# EAGLE design Full_Schematic (EAGLE 9.6.2)
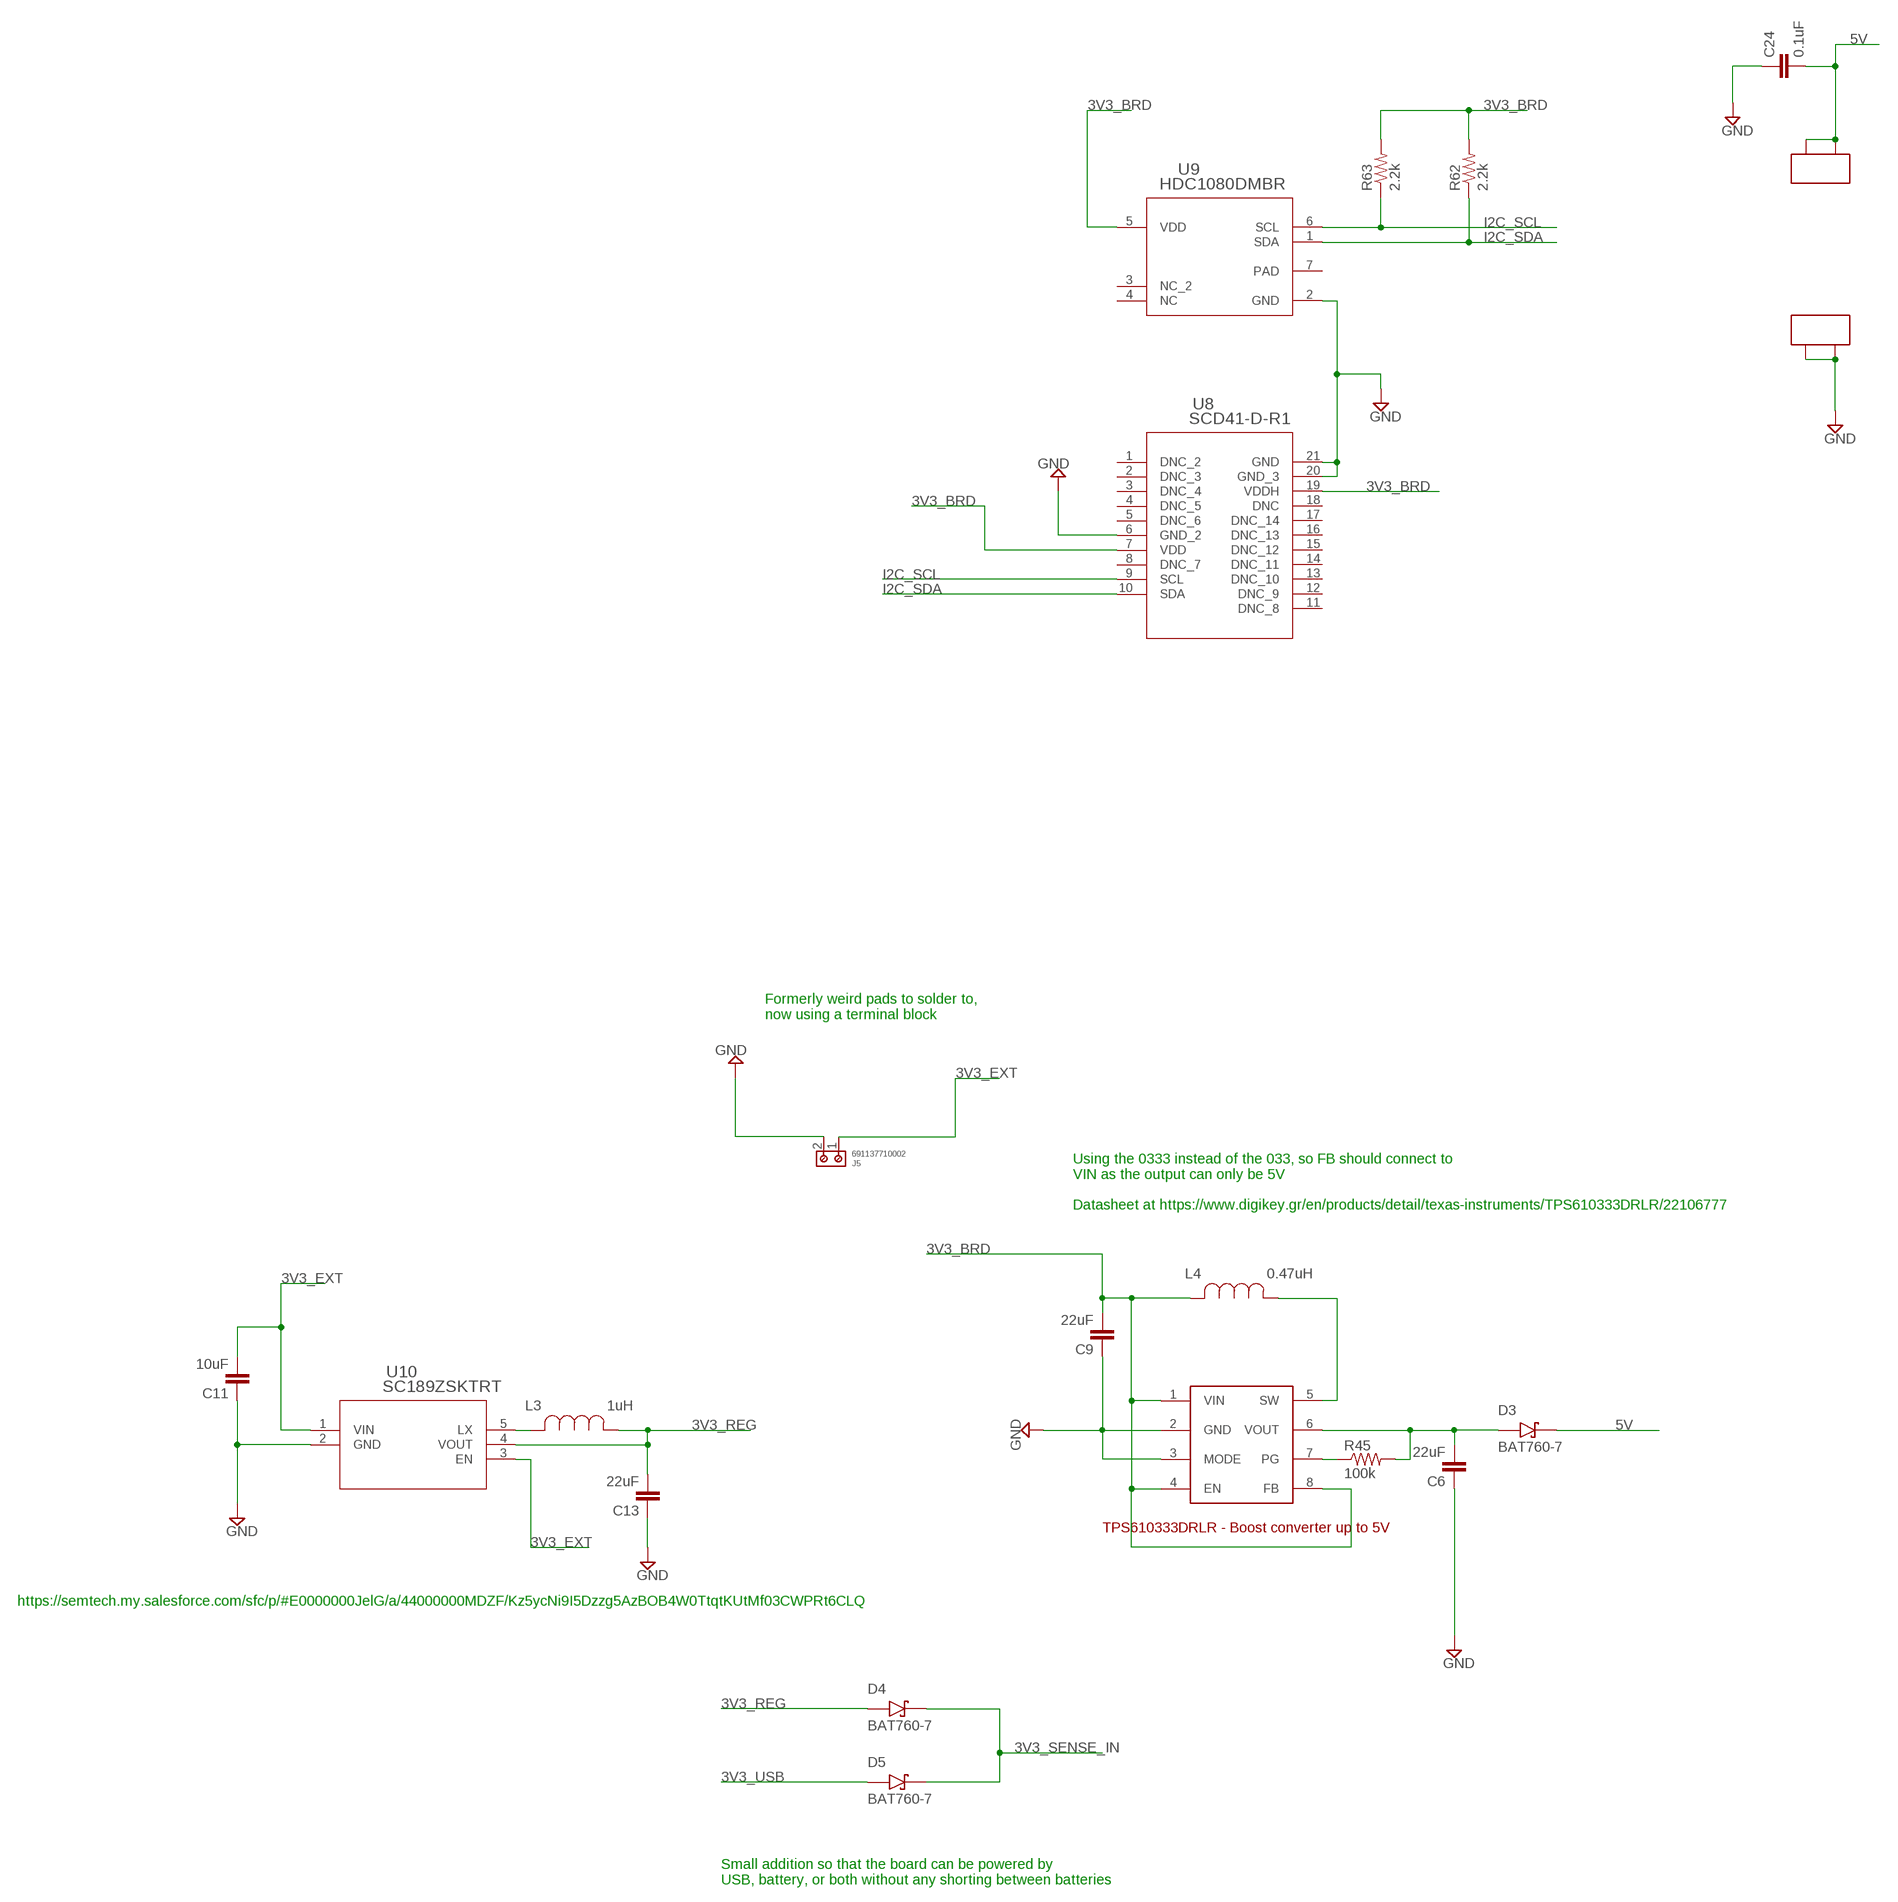
[diagram p0: schematic, sheet 1, part 1 of 3]
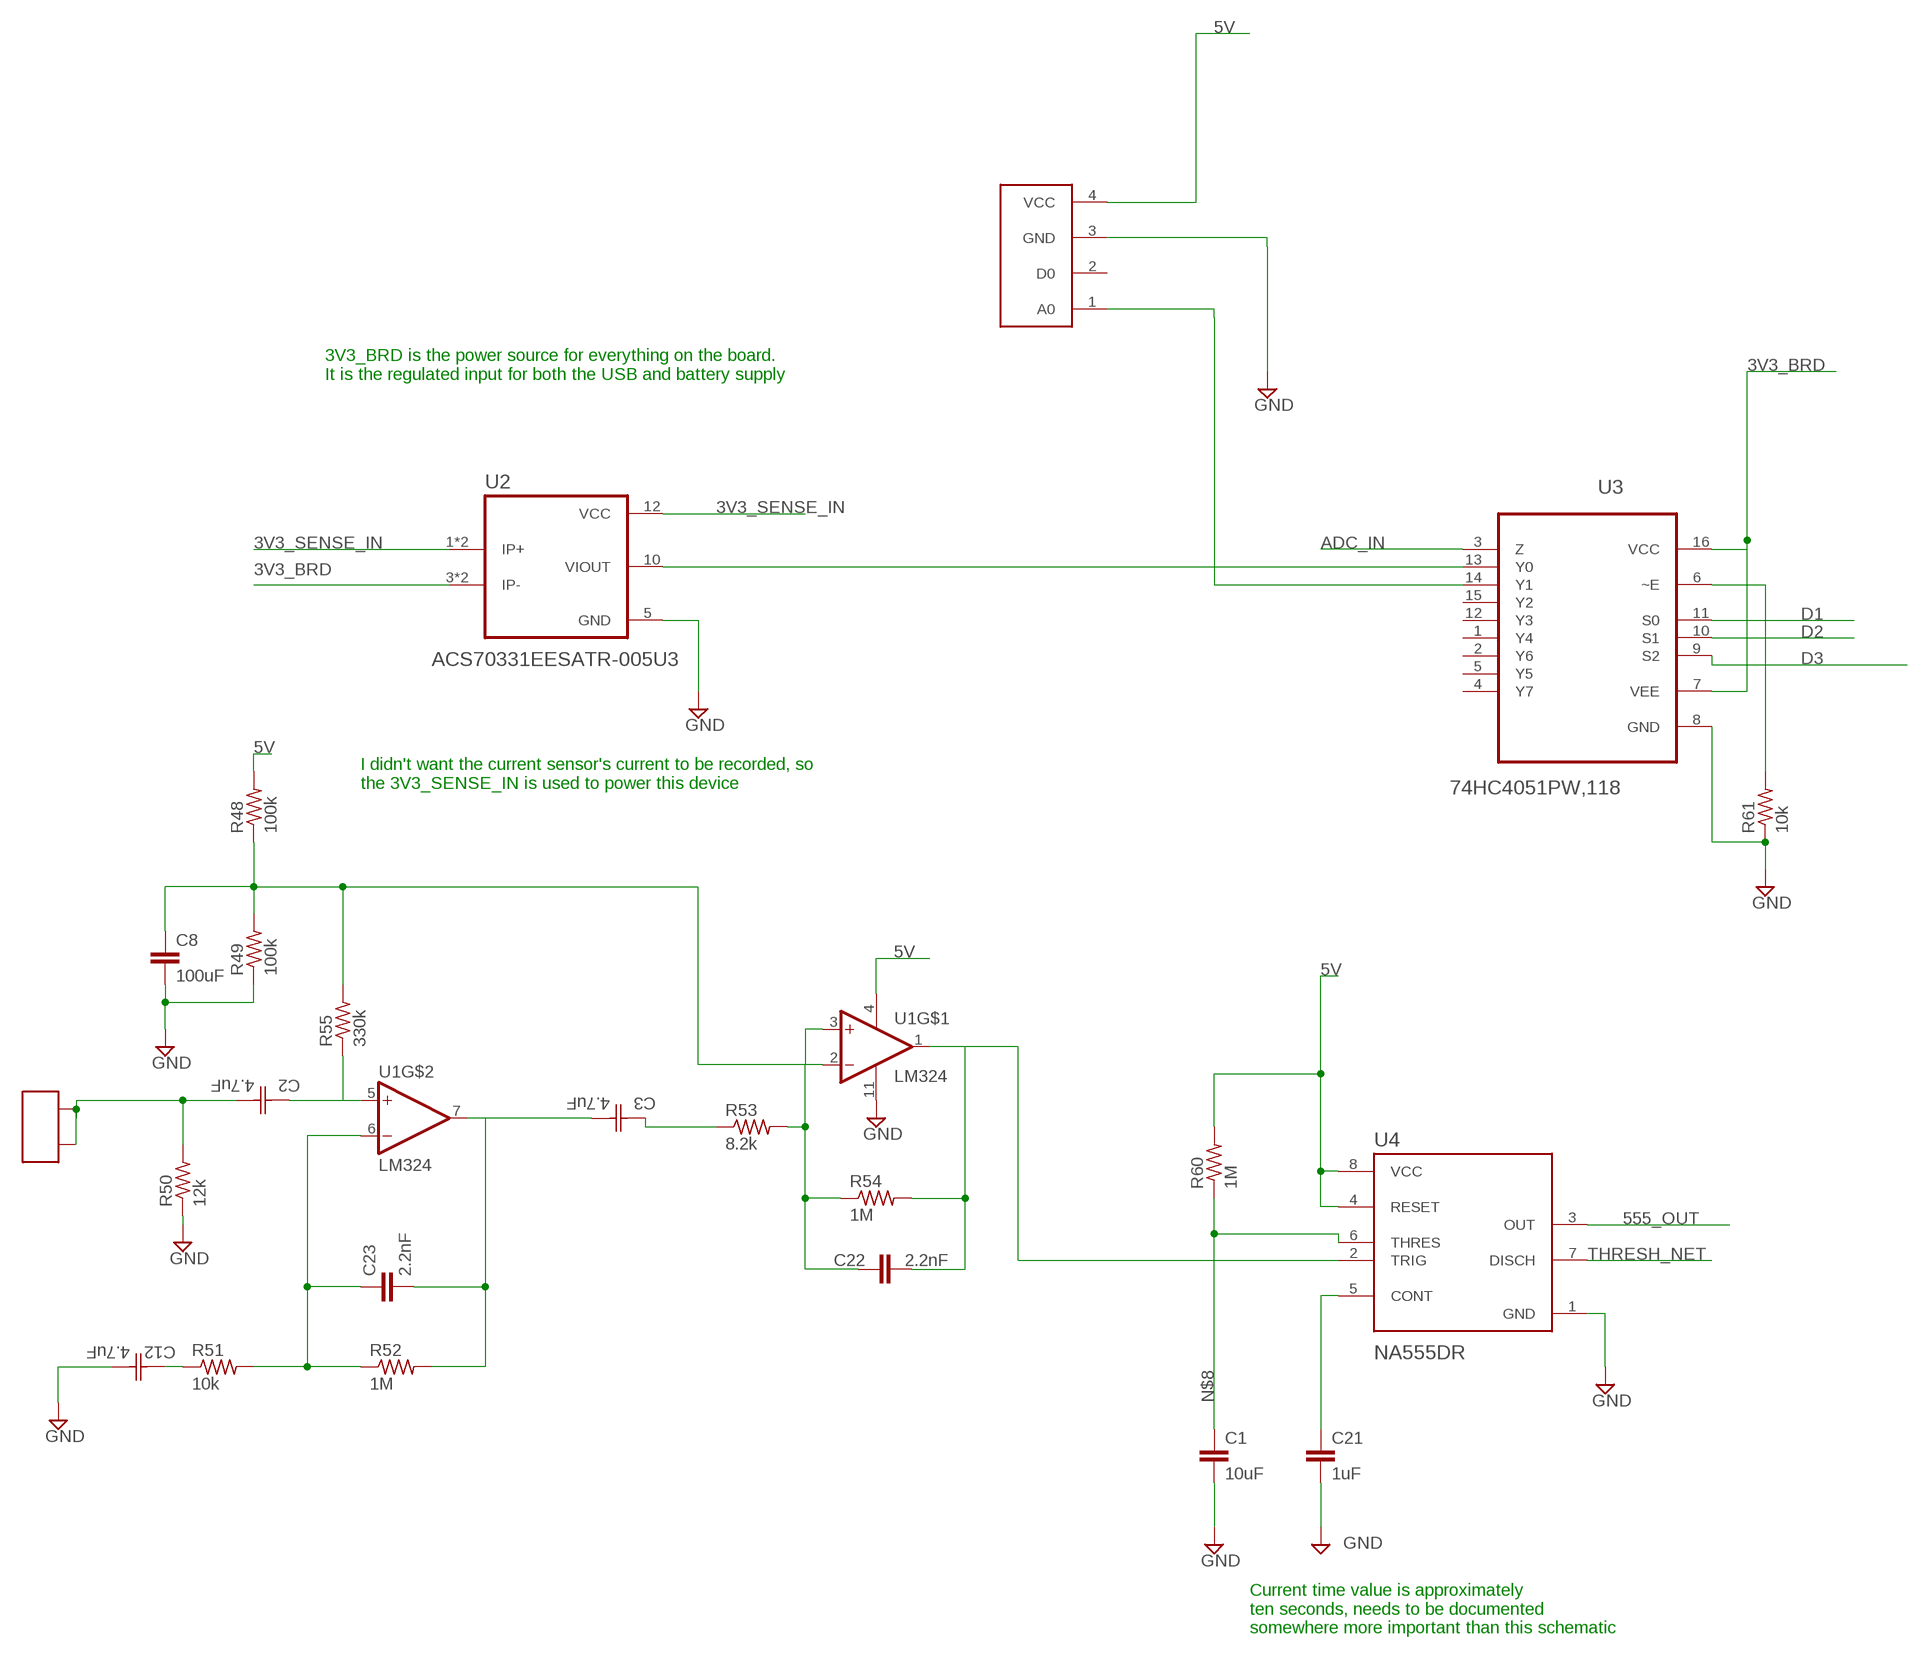
[diagram p1: schematic, sheet 1, part 2 of 3]
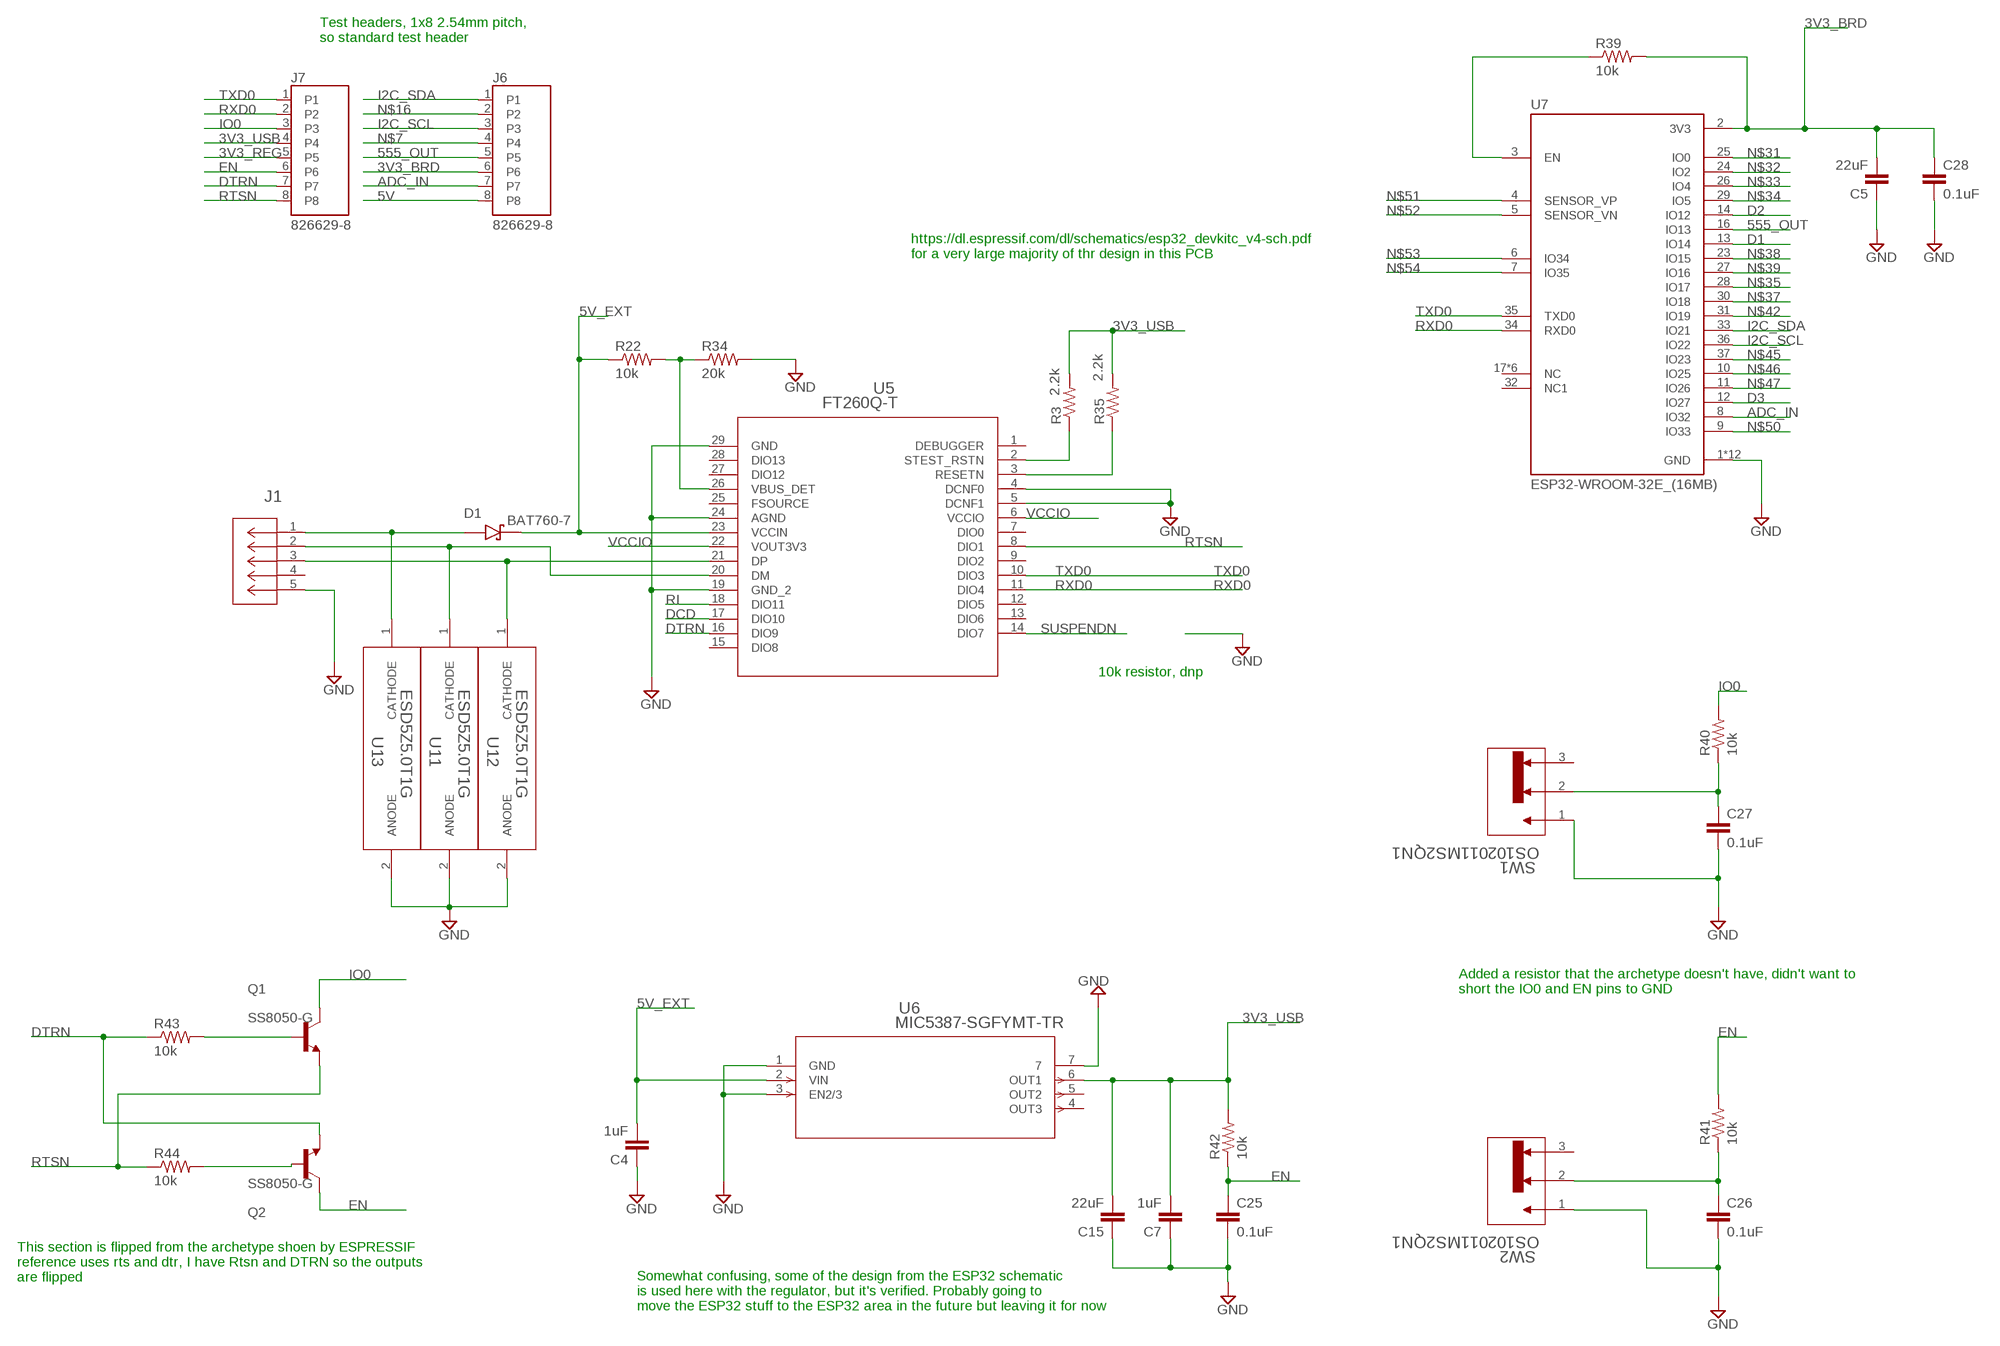
[diagram p2: schematic, sheet 1, part 3 of 3]

## Parts
C1  10uF  C-EUC0603  [C0603]
C2  4.7uF  860020472001  [CAP_WCAP-ATG5_5X11_WRE]
C3  4.7uF  860020472001  [CAP_WCAP-ATG5_5X11_WRE]
C4  1uF  C-EUC0603  [C0603]
C5  22uF  C-EUC0603  [C0603]
C6  22uF  C-EUC0603  [C0603]
C7  1uF  C-EUC0603  [C0603]
C8  100uF  C-EUC1206  [C1206]
C9  22uF  C-EUC0603  [C0603]
C11  10uF  C-EUC0603  [C0603]
C12  4.7uF  860020472001  [CAP_WCAP-ATG5_5X11_WRE]
C13  22uF  C-EUC0603  [C0603]
C15  22uF  C-EUC0603  [C0603]
C21  1uF  C-EUC0402  [C0402]
C22  2.2nF  C-EUC0402  [C0402]
C23  2.2nF  C-EUC0402  [C0402]
C24  0.1uF  C-EUC0402  [C0402]
C25  0.1uF  C-EUC0402  [C0402]
C26  0.1uF  C-EUC0402  [C0402]
C27  0.1uF  C-EUC0402  [C0402]
C28  0.1uF  C-EUC0402  [C0402]
D1  BAT760-7  [SOD2513X120N]
D3  BAT760-7  [SOD2513X120N]
D4  BAT760-7  [SOD2513X120N]
D5  BAT760-7  [SOD2513X120N]
J1  10118193-0001LF  [CONN_10118193-0001LF_AMP]
J5  691137710002  [691137710002]
J6  826629-8  [TE_826629-8]
J7  826629-8  [TE_826629-8]
L3  1uH  DFE252012P-1R0M=P2  [DFE252012P-1R0M=P2]
L4  0.47uH  DFE252012P-1R0M=P2  [DFE252012P-1R0M=P2]
Q1  SS8050-G  [TRANS_SS8050-G]
Q2  SS8050-G  [TRANS_SS8050-G]
R3  2.2k  R-US_R0402  [R0402]
R22  10k  R-US_R0402  [R0402]
R34  20k  R-US_R0402  [R0402]
R35  2.2k  R-US_R0402  [R0402]
R39  10k  R-US_R0402  [R0402]
R40  10k  R-US_R0402  [R0402]
R41  10k  R-US_R0402  [R0402]
R42  10k  R-US_R0402  [R0402]
R43  10k  R-US_R0402  [R0402]
R44  10k  R-US_R0402  [R0402]
R45  100k  R-US_R0402  [R0402]
R48  100k  R-US_R0402  [R0402]
R49  100k  R-US_R0402  [R0402]
R50  12k  R-US_R0402  [R0402]
R51  10k  R-US_R0402  [R0402]
R52  1M  R-US_R0402  [R0402]
R53  8.2k  R-US_R0402  [R0402]
R54  1M  R-US_R0402  [R0402]
R55  330k  R-US_R0402  [R0402]
R60  1M  R-US_R0402  [R0402]
R61  10k  R-US_R0402  [R0402]
R62  2.2k  R-US_R0402  [R0402]
R63  2.2k  R-US_R0402  [R0402]
SW1  OS102011MS2QN1  [SPDT_OS102011_CNK]
SW2  OS102011MS2QN1  [SPDT_OS102011_CNK]
U1  LM324  [SOIC127P600X175-14N]
U2  ACS70331EESATR-005U3  [ALLEGRO_ACS70331EESATR-005U3]
U3  74HC4051PW,118  [SOP65P640X110-16N]
U4  NA555DR  [SOIC127P599X175-8N]
U5  FT260Q-T  [WQFN-28_FTD]
U6  MIC5387-SGFYMT-TR  [MLF-6_MT_MCH]
U7  ESP32-WROOM-32E_(16MB)  [XCVR_ESP32-WROOM-32E_(16MB)]
U8  SCD41-D-R1  [SCD41-D-R1_SEN]
U9  HDC1080DMBR  [DMB0006A]
U10  SC189ZSKTRT  [SOT23-5-SC189_SEM]
U11  ESD5Z5.0T1G  [SOD-523_0P9X1P3_ONS]
U12  ESD5Z5.0T1G  [SOD-523_0P9X1P3_ONS]
U13  ESD5Z5.0T1G  [SOD-523_0P9X1P3_ONS]
U$1  2PIN_HEADER  [2PIN_HEADER]
U$2  2PIN_HEADER  [2PIN_HEADER]
U$3  MQ_7  [MQ-7]
U$4  TPS610333DRLR  [TPS610333DRLR]
U$5  2PIN_HEADER  [2PIN_HEADER]

## Nets
3V3_BRD: C5.2 C9.2 C28.1 J6.6 L4.2 R39.2 R62.2 R63.2 U2.3(IP-) U2.4(IP-) U3.7(VEE) U3.16(VCC) U7.2(3V3) U8.7(VDD) U8.19(VDDH) U9.5(VDD) U$4.1(VIN) U$4.4(EN) U$4.8(FB)
3V3_EXT: C11.2 J5.1 U10.1(VIN) U10.3(EN)
3V3_REG: C13.2 D4.A J7.5 L3.1 U10.4(VOUT)
3V3_SENSE_IN: D4.C(K) D5.C(K) U2.1(IP+) U2.2(IP+) U2.12(VCC)
3V3_USB: C7.2 C15.2 D5.A J7.4 R3.2 R35.2 R42.2 U6.6(OUT1)
5V: C24.2 D3.C(K) J6.8 R48.2 R60.2 U1.4(VCC+) U4.4(RESET) U4.8(VCC) U$2.1 U$2.2 U$3.4(VCC)
5V1: C6.2 D3.A R45.2 U$4.6(VOUT)
5V_EXT: C4.2 D1.C(K) R22.1 U5.23(VCCIN) U6.2(VIN)
555_OUT: J6.5 U4.3(OUT) U7.16(IO13)
ADC_IN: J6.7 U3.3(Z) U7.8(IO32)
D1: U3.11(S0) U7.13(IO14)
D2: U3.10(S1) U7.14(IO12)
D3: U3.9(S2) U7.12(IO27)
DCD: U5.17(DIO10)
DTRN: J7.7 Q2.2(E) R43.1 U5.16(DIO9)
EN: C25.1 J7.6 Q2.3(C) R41.2 R42.1
GND: C1.2 C4.1 C5.1 C6.1 C7.1 C8.2 C9.1 C11.1 C12.2 C13.1 C15.1 C21.2 C24.1 C25.2 C26.2 C27.2 C28.2 J1.5 J5.2 R34.2 R49.1 R50.1 R61.1 SW1.1 SW2.1 U1.11(VCC-) U2.5(GND) U3.8(GND) U4.1(GND) U5.4(DCNF0) U5.5(DCNF1) U5.19(GND_2) U5.24(AGND) U5.29(GND) U6.1(GND) U6.3(EN2/3) U6.7 U7.1(GND) U7.15(GND) U7.38(GND) U7.39_1(GND) U7.39_2(GND) U7.39_3(GND) U7.39_4(GND) U7.39_5(GND) U7.39_6(GND) U7.39_7(GND) U7.39_8(GND) U7.39_9(GND) U8.6(GND_2) U8.20(GND_3) U8.21(GND) U9.2(GND) U10.2(GND) U11.2(ANODE) U12.2(ANODE) U13.2(ANODE) U$3.3(GND) U$4.2(GND) U$4.3(MODE) U$5.1 U$5.2
I2C_SCL: J6.3 R63.1 U7.36(IO22) U8.9(SCL) U9.6(SCL)
I2C_SDA: J6.1 R62.1 U7.33(IO21) U8.10(SDA) U9.1(SDA)
IO0: J7.3 Q1.3(C) R40.2
N$2: C26.1 R41.1 SW2.2
N$3: C23.1 R51.2 R52.1 U1.6(INVERTING_INPUT2)
N$4: C3.2 C23.2 R52.2 U1.7(OUTPUT2)
N$5: C3.1 R53.1
N$6: C22.1 R53.2 R54.1 U1.3(NON-INVERTING_INPUT1)
N$7: J6.4 U2.10(VIOUT) U3.13(Y0)
N$8: C1.1 R60.1 U4.6(THRES)
N$9: C8.1 R48.1 R49.2 R55.2 U1.2(INVERTING_INPUT1)
N$10: C27.1 R40.1 SW1.2
N$12: C12.1 R51.1
N$16: J6.2 U3.14(Y1) U$3.1(A0)
N$19: C21.1 U4.5(CONT)
N$20: D1.A J1.1 U13.1(CATHODE)
N$21: R61.2 U3.6(~E)
N$22: J1.2 U5.20(DM) U11.1(CATHODE)
N$23: J1.3 U5.21(DP) U12.1(CATHODE)
N$24: Q1.1(B) R43.2
N$25: Q2.1(B) R44.2
N$26: R35.1 U5.3(RESETN)
N$27: R22.2 R34.1 U5.26(VBUS_DET)
N$28: R39.1 U7.3(EN)
N$29: C2.2 R50.2 U$1.1 U$1.2
N$30: R3.1 U5.2(STEST_RSTN)
N$31: U7.25(IO0)
N$32: U7.24(IO2)
N$33: U7.26(IO4)
N$34: U7.29(IO5)
N$35: U7.28(IO17)
N$37: U7.30(IO18)
N$38: U7.23(IO15)
N$39: U7.27(IO16)
N$42: U7.31(IO19)
N$45: U7.37(IO23)
N$46: U7.10(IO25)
N$47: U7.11(IO26)
N$50: U7.9(IO33)
N$51: U7.4(SENSOR_VP)
N$52: U7.5(SENSOR_VN)
N$53: U7.6(IO34)
N$54: U7.7(IO35)
N$55: L3.2 U10.5(LX)
N$56: L4.1 U$4.5(SW)
N$57: R45.1 U$4.7(PG)
N$60: C2.1 R55.1 U1.5(NON-INVERTING_INPUT2)
RI: U5.18(DIO11)
RTSN: J7.8 Q1.2(E) R44.1 U5.8(DIO1)
RXD0: J7.2 U5.11(DIO4) U7.34(RXD0)
SUSPENDN: U5.14(DIO7)
THRESH_NET: C22.2 R54.2 U1.1(OUTPUT1) U4.2(TRIG) U4.7(DISCH)
TXD0: J7.1 U5.10(DIO3) U7.35(TXD0)
VCCIO: U5.6(VCCIO) U5.22(VOUT3V3)
Unconnected: J1.4 SW1.3 SW2.3 U1.8(OUTPUT3) U1.9(INVERTING_INPUT3) U1.10(NON-INVERTING_INPUT3) U1.12(NON-INVERTING_INPUT4) U1.13(INVERTING_INPUT4) U1.14(OUTPUT4) U3.1(Y4) U3.2(Y6) U3.4(Y7) U3.5(Y5) U3.12(Y3) U3.15(Y2) U5.1(DEBUGGER) U5.7(DIO0) U5.9(DIO2) U5.12(DIO5) U5.13(DIO6) U5.15(DIO8) U5.27(DIO12) U5.28(DIO13) U6.4(OUT3) U6.5(OUT2) U7.17(NC) U7.18(NC) U7.19(NC) U7.20(NC) U7.21(NC) U7.22(NC) U7.32(NC1) U8.1(DNC_2) U8.2(DNC_3) U8.3(DNC_4) U8.4(DNC_5) U8.5(DNC_6) U8.8(DNC_7) U8.11(DNC_8) U8.12(DNC_9) U8.13(DNC_10) U8.14(DNC_11) U8.15(DNC_12) U8.16(DNC_13) U8.17(DNC_14) U8.18(DNC) U9.3(NC_2) U9.4(NC) U$3.2(D0)

## Notes on the sheet
- 3V3_BRD is the power source for everything on the board.
  It is the regulated input for both the USB and battery supply
- I didn't want the current sensor's current to be recorded, so
  the 3V3_SENSE_IN is used to power this device
- Current time value is approximately
  ten seconds, needs to be documented
  somewhere more important than this schematic
- Test headers, 1x8 2.54mm pitch,
  so standard test header
- Formerly weird pads to solder to,
  now using a terminal block
- https://dl.espressif.com/dl/schematics/esp32_devkitc_v4-sch.pdf
  for a very large majority of thr design in this PCB
- Using the 0333 instead of the 033, so FB should connect to 
  VIN as the output can only be 5V
  
  Datasheet at https://www.digikey.gr/en/products/detail/texas-instruments/TPS610333DRLR/22106777
- 10k resistor, dnp
- https://semtech.my.salesforce.com/sfc/p/#E0000000JelG/a/44000000MDZF/Kz5ycNi9I5Dzzg5AzBOB4W0TtqtKUtMf03CWPRt6CLQ
- Added a resistor that the archetype doesn't have, didn't want to 
  short the IO0 and EN pins to GND
- Small addition so that the board can be powered by
  USB, battery, or both without any shorting between batteries
- This section is flipped from the archetype shoen by ESPRESSIF
  reference uses rts and dtr, I have Rtsn and DTRN so the outputs
  are flipped
- Somewhat confusing, some of the design from the ESP32 schematic
  is used here with the regulator, but it's verified. Probably going to 
  move the ESP32 stuff to the ESP32 area in the future but leaving it for now

## Power pins joined to a net without a drawn wire
FSOURCE: U5.25(FSOURCE)
PAD: U9.7(PAD)

## Library data of the parts
C1 C4-C9 C11 C13 C15 C21-C28 = rcl:C-EU: CAPACITOR, European symbol; SPICEPREFIX: C
C2 C3 C12 = 860020472001:860020472001; COPYRIGHT: Copyright (C) 2024 Ultra Librarian. All rights reserved.; MANUFACTURER_PART_NUMBER: 860020472001; MFR_NAME: Wurth Electronics
D1 D3-D5 = BAT760-7:BAT760-7: Diode Schottky 30V 1A Surface Mount SOD-323; MANUFACTURER: DIODES; MAXIMUM_PACKAGE_HEIGHT: 1.20mm; PARTREV: 9-2; STANDARD: IPC-7351B
J1 = USB:10118193-0001LF; COPYRIGHT: Copyright (C) 2024 Ultra Librarian. All rights reserved.; MANUFACTURER_PART_NUMBER: 10118193-0001LF; MFR_NAME: Amphenol ICC; TYPE: USB, DVI, HDMI, Connectors
J5 = 691137710002:691137710002: WR-TBL Serie 1377 - 5.00 mm Horiz Entry w. Pressure Clamp Glow Wire KIND PROPERTIES Pitch 5 mm MATERIAL PROPERTIES Insulator Material PA6/66 Insulator Flammability Rating UL94 V-0 Insulator Color Green Contact Material Copper Alloy Contact Plating Tin over Nickel Terminal Screw Material Steel Terminal Screw Plating Zinc Wire Guard Material Copper Alloy with Tin GENERAL INFORMATION Operating Temperature -30 up to +120 °C Compliance Lead free / RoHS ELECTRICAL PROPERTIES IR UL 16 A IR VDE 24 A Working Voltage [UL] 300 V (AC) Working Voltage [VDE] 250 V (AC) Withstanding Voltage [UL] 1600 V (AC) Withstanding Voltage [VDE] 2000 V (AC) Contact Resistance 20 mΩ Contact Resistance [UL] 20 mΩ Contact Resistance [VDE] 20 mΩ MECHANICAL PROPERTIES Wire Strip Length 6 (mm) Screw M2.5 Solid Wire Section (AWG) 12 to 30 (AWG) Solid Wire Section (Metric) 3.31 to 0.05 (mm²) Stranded Wire Section (AWG) 12 to 30 (AWG) Stranded Wire Section (Metric) 3.31 to 0.05 (mm²) CERTIFICATION UL Approval E150931 VDE Approval 40021397 PACKAGING PROPERTIES Packaging Box <https://katalog.we-online.com/media/images/v2/o84014v209%20Family_WR-TBL1_6911377100xx.jpg> Details see: https://katalog.we-online.com/en/em/TBL_5_00_1377_HORIZONTAL_ENTRY_W_PRESSURE_CLAMP_GLOW_WIRE_6911377100xx Updated by Ella Wu 2019-11-08 2019(C) Wurth Elektronik Check availability <https://pricing.snapeda.com/parts/691137710002/Wurth%20Electronics/view-part?ref=eda>; AVAILABILITY: In Stock; CHECK_PRICES: https://www.snapeda.com/parts/691137710002/Wurth+Electronics+Inc./view-part/?ref=eda; DESCRIPTION: 2 Position Wire to Board Terminal Block Horizontal with Board 0.197 (5.00mm) Through Hole; MF: Wurth Electronics; MP: 691137710002; PACKAGE: None; PRICE: None; PURCHASE-URL: https://www.snapeda.com/api/url_track_click_mouser/?unipart_id=1195404&manufacturer=Wurth Electronics&part_name=691137710002&search_term=None; SNAPEDA_LINK: https://www.snapeda.com/parts/691137710002/Wurth+Electronics+Inc./view-part/?ref=snap
J6 J7 = 826629-8:826629-8: Pin header; pin strips; AMPMODU MOD II; male; PIN: 8; straight Check availability <https://pricing.snapeda.com/parts/826629-8/TE%20Connectivity/view-part?ref=eda>; AVAILABILITY: In Stock; CHECK_PRICES: https://www.snapeda.com/parts/826629-8/TE+Connectivity+AMP+Connectors/view-part/?ref=eda; COMMENT: 826629-8; DESCRIPTION: Conn Unshrouded Header HDR 8 POS 2.54mm Solder ST Thru-Hole Automotive Box; EU_ROHS_COMPLIANCE: Compliant; MF: TE Connectivity; MP: 826629-8; PACKAGE: None; PRICE: None; PURCHASE-URL: https://www.snapeda.com/api/url_track_click_mouser/?unipart_id=456641&manufacturer=TE Connectivity&part_name=826629-8&search_term=None; SNAPEDA_LINK: https://www.snapeda.com/parts/826629-8/TE+Connectivity+AMP+Connectors/view-part/?ref=snap
L3 L4 = 2520_Inductor:DFE252012P-1R0M=P2: Inductor of size 2520 metric; COPYRIGHT: Copyright (C) 2024 Ultra Librarian. All rights reserved.; MANUFACTURER_PART_NUMBER: DFE252012P-1R0M=P2; MFR_NAME: Murata
Q1 Q2 = SS8050-G:SS8050-G: Bipolar (BJT) Transistor NPN 25 V 1.5 A 100MHz 300 mW Surface Mount SOT-23-3; MANUFACTURER: Comchip; MAXIMUM_PACKAGE_HEIGHT: 1.05 mm; PARTREV: A; STANDARD: Manufacturer Recommendations
R3 R22 R34 R35 R39-R45 R48-R55 R60-R63 = rcl:R-US_: RESISTOR, American symbol; SPICEPREFIX: R
SW1 SW2 = OS102011MS2QN1:OS102011MS2QN1; COPYRIGHT: Copyright (C) 2024 Ultra Librarian. All rights reserved.; MANUFACTURER_PART_NUMBER: OS102011MS2QN1; MFR_NAME: C&K Components; TYPE: Slide Switches
U1 = LM324:LM324: these devices consist of four independent high-gain frequency-compensated operational amplifiers that are designed sp... Check availability <https://pricing.snapeda.com/parts/LM324../Intersil/view-part?ref=eda>; AVAILABILITY: Not in stock; CHECK_PRICES: https://www.snapeda.com/parts/LM324../Intersil/view-part/?ref=eda; DESCRIPTION: Op Amp Quad Low Voltage Amplifier ±2.75V/5.5V 14-Pin SOIC T/R; MF: Intersil; MP: LM324..; PACKAGE: None; PRICE: None; SNAPEDA_LINK: https://www.snapeda.com/parts/LM324../Intersil/view-part/?ref=snap
U2 = ACS70331EESATR-005U3:ACS70331EESATR-005U3: High Sensitivity, 1 Mhz, Gmr-Bas Check availability <https://pricing.snapeda.com/parts/ACS70331EESATR-005U3/Allegro%20MicroSystems%20LLC/view-part?ref=eda>; AVAILABILITY: In Stock; CHECK_PRICES: https://www.snapeda.com/parts/ACS70331EESATR-005U3/Allegro+MicroSystems+LLC/view-part/?ref=eda; DESCRIPTION: Current Sensor 5A 1 Channel Hall Effect, Open Loop Unidirectional 12-PowerWFQFN; MF: Allegro MicroSystems LLC; MP: ACS70331EESATR-005U3; PACKAGE: WFQFN-12 Allegro MicroSystems LLC; PRICE: None; PURCHASE-URL: https://www.snapeda.com/api/url_track_click_mouser/?unipart_id=2732756&manufacturer=Allegro MicroSystems LLC&part_name=ACS70331EESATR-005U3&search_term=None; SNAPEDA_LINK: https://www.snapeda.com/parts/ACS70331EESATR-005U3/Allegro+MicroSystems+LLC/view-part/?ref=snap
U3 = 74HC4051PW_118:74HC4051PW,118: 8-channel analog multiplexer/demultiplexer Check availability <https://pricing.snapeda.com/parts/74HC4051PW%2C118/Nexperia%20USA%20Inc./view-part?ref=eda>; AVAILABILITY: In Stock; CHECK_PRICES: https://www.snapeda.com/parts/74HC4051PW,118/Nexperia/view-part/?ref=eda; DESCRIPTION: 1 Circuit IC Switch 8:1 120Ohm 16-TSSOP; MF: Nexperia USA Inc.; MP: 74HC4051PW,118; PACKAGE: TSSOP-16 Texas Instruments; PRICE: None; PURCHASE-URL: https://www.snapeda.com/api/url_track_click_mouser/?unipart_id=5160680&manufacturer=Nexperia USA Inc.&part_name=74HC4051PW,118&search_term=None; SNAPEDA_LINK: https://www.snapeda.com/parts/74HC4051PW,118/Nexperia/view-part/?ref=snap
U4 = NA555DR:NA555DR: Precision Timers 8-SOIC -40 to 105; MANUFACTURER: Texas Instruments; MAXIMUM_PACKAGE_HEIGHT: 1.75mm; PARTREV: I; STANDARD: IPC-7351B
U5 = FT260Q_T:FT260Q-T; COPYRIGHT: Copyright (C) 2024 Ultra Librarian. All rights reserved.; MANUFACTURER_PART_NUMBER: FT260Q-T; MFR_NAME: FTDI, Future Technology Devices International Ltd
U6 = MIC5387_5V_to_3V3:MIC5387-SGFYMT-TR; COPYRIGHT: Copyright (C) 2024 Ultra Librarian. All rights reserved.; MANUFACTURER_PART_NUMBER: MIC5387-SGFYMT-TR; MFR_NAME: Microchip
U7 = ESP32-WROOM-32E__16MB_:ESP32-WROOM-32E_(16MB): Check availability <https://pricing.snapeda.com/parts/ESP32-WROOM-32E%20%2816MB%29/Espressif%20Systems/view-part?ref=eda>; AVAILABILITY: Not in stock; CHECK_PRICES: https://www.snapeda.com/parts/ESP32-WROOM-32E%20(16MB)/Espressif+Systems/view-part/?ref=eda; DESCRIPTION: Bluetooth, WiFi 802.11b/g/n, Bluetooth v4.2 +EDR, Class 1, 2 and 3 Transceiver Module 2.4GHz ~ 2.5GHz Integrated, Trace Surface Mount; MF: Espressif Systems; MP: ESP32-WROOM-32E (16MB); PACKAGE: SMD-44 Espressif Systems; PRICE: None; SNAPEDA_LINK: https://www.snapeda.com/parts/ESP32-WROOM-32E%20(16MB)/Espressif+Systems/view-part/?ref=snap
U8 = SCD41:SCD41-D-R1: SCD41 is a CO2 sensor that supports I2C communication and can read 400ppm to 5000ppm; COPYRIGHT: Copyright (C) 2024 Ultra Librarian. All rights reserved.; MANUFACTURER_PART_NUMBER: SCD41-D-R1; MFR_NAME: Sensirion
U9 = Temperature_Humidity_Sensor:HDC1080DMBR: Temperature and humidity sensor that functions over I2C protocol; COPYRIGHT: Copyright (C) 2024 Ultra Librarian. All rights reserved.; MANUFACTURER_PART_NUMBER: HDC1080DMBR; MFR_NAME: Texas Instruments; REFDES: RefDes; TYPE: TYPE
U10 = SC189ZSKTRT_3V3:SC189ZSKTRT; COPYRIGHT: Copyright (C) 2024 Ultra Librarian. All rights reserved.; MANUFACTURER_PART_NUMBER: SC189ZSKTRT; MFR_NAME: Semtech
U11-U13 = Circuit_protection_diode:ESD5Z5.0T1G; COPYRIGHT: Copyright (C) 2024 Ultra Librarian. All rights reserved.; MANUFACTURER_PART_NUMBER: ESD5Z5.0T1G; MFR_NAME: onsemi
U$1 U$2 U$5 = 2PIN_HEADER:2PIN_HEADER
U$3 = MQ_7:MQ_7: MQ_7 gas sensor, this part can be used for all of the 'MQ' series of gas sensors (the dev board not the sensor by itself)
U$4 = TPS610333DRLR:TPS610333DRLR: TPS610333DRLR is a linear boost converter that takes an input of 3V-4.35V and outputs 5V

## Board
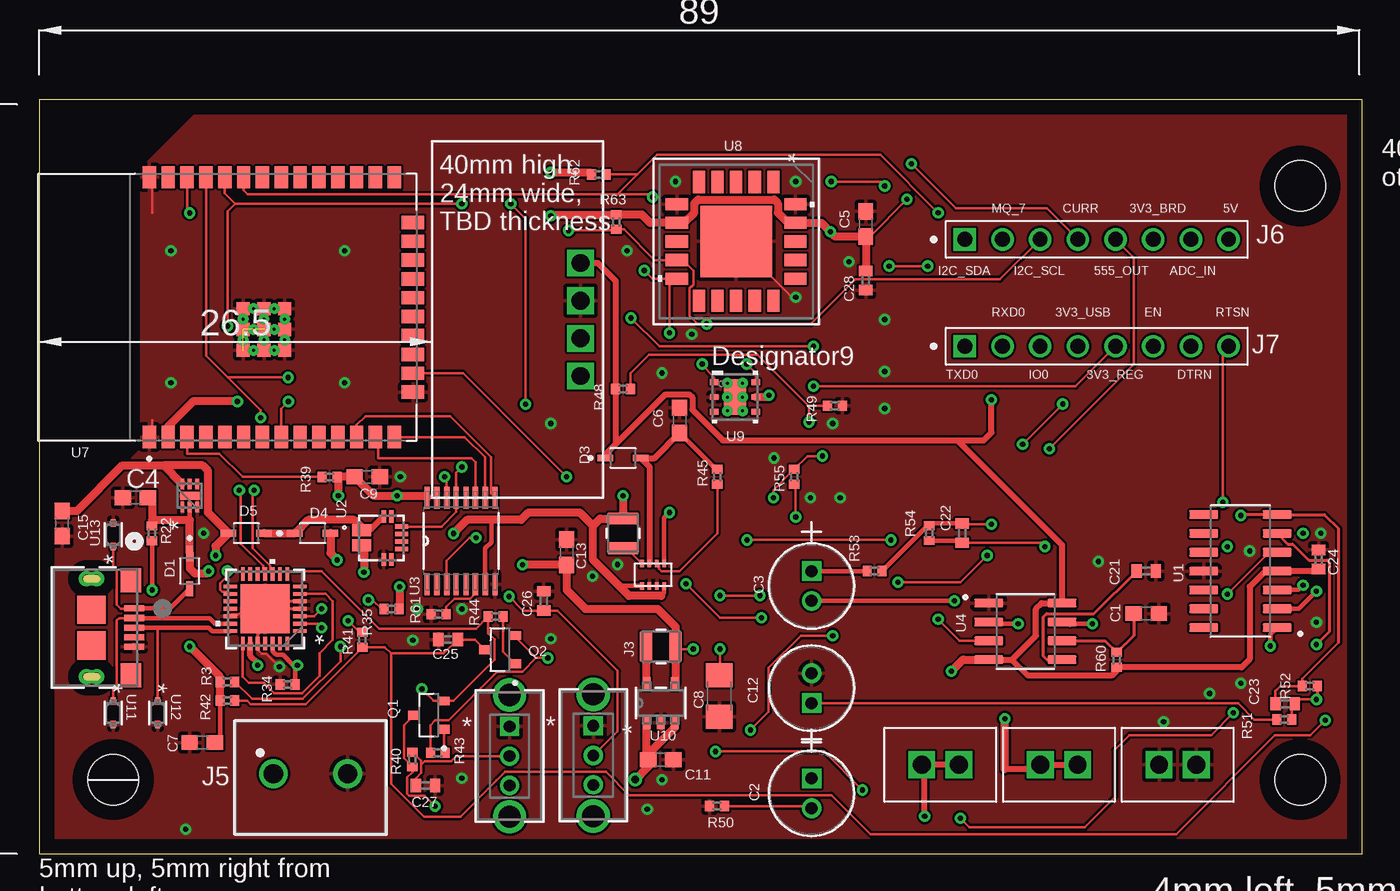
[diagram p3: board, top side]
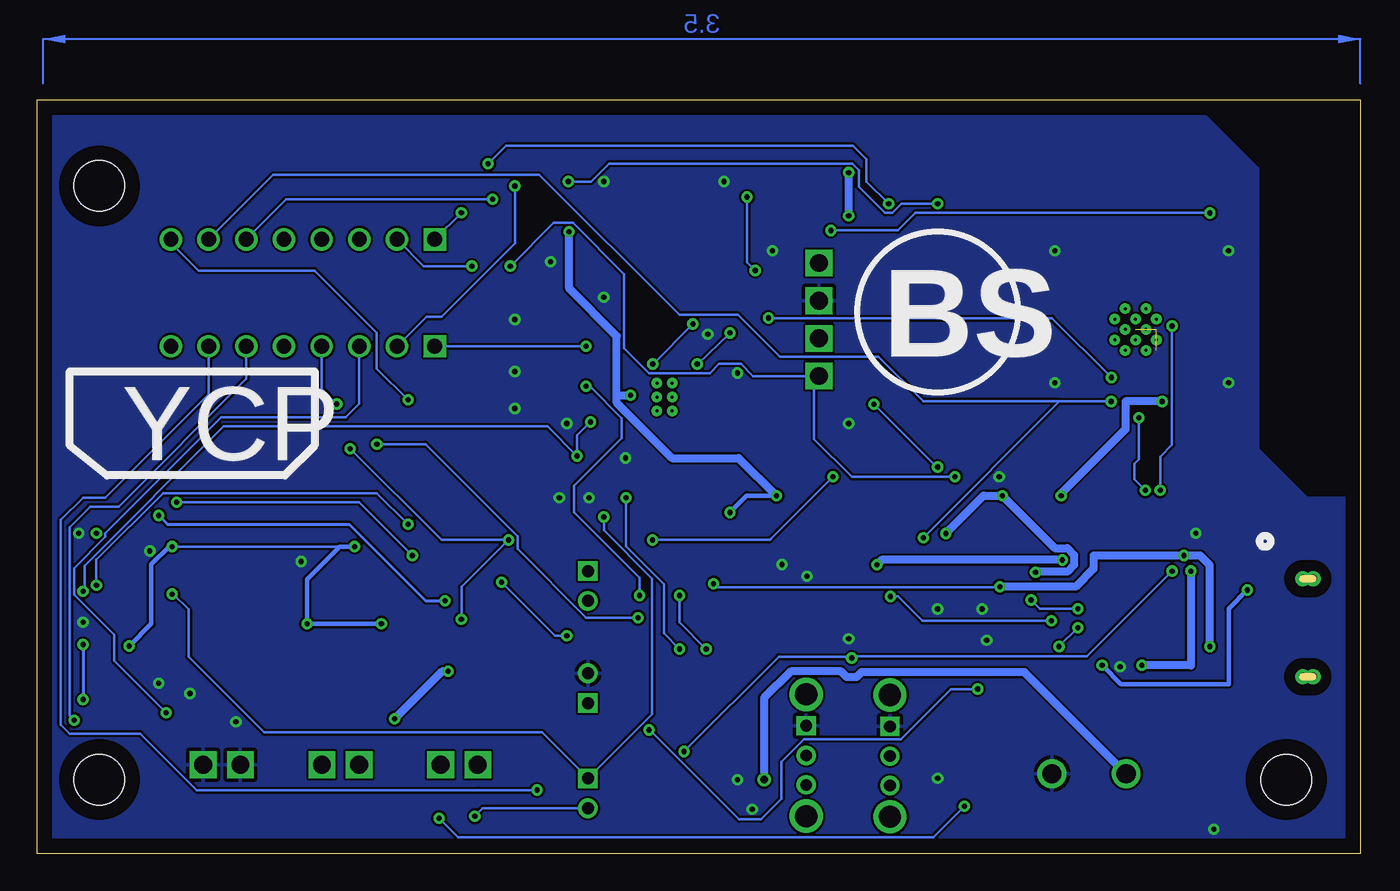
[diagram p4: board, bottom side, seen from below]

Size 89.2 x 50.8 mm. Coordinates in mm from the lower left corner, seen from the top.
Outline: 0,0 89.2,0 89.2,50.8 0,50.8 0,0
Copper layers (1*16): Top 0.035mm / dielectric 1.5mm / Bottom 0.035mm
Design rules "default": minimum track width 6mil, minimum drill 0.35mm, track to track 6mil, track to pad 6mil, pad to pad 6mil, via to via 6mil, smd to smd 6mil, copper to edge 40mil, drill to drill 6mil, minimum pad ring 10mil, minimum via ring 8mil, stop-mask expansion 4mil, vias tented up to drill 0mil, thermal gap 10mil
Holes 3.4 mm at 5,5 85,5 85,45

### Footprints (pad centres in the part's own frame; a part is rotated, then mirrored left to right if it is on the bottom)
C0603 = smd 1.1 x 1: 1 -0.85,0; 2 0.85,0
CAP_WCAP-ATG5_5X11_WRE = drill 0.813 pad 1.321 square: 1 0,0 | drill 0.813 pad 1.321: 2 2.007,0
C1206 = smd 1.6 x 1.8: 1 -1.4,0; 2 1.4,0
C0402 = smd 0.7 x 0.9: 1 -0.65,0; 2 0.65,0
SOD2513X120N = smd 1.04 x 0.46: A 1.19,0; C -1.19,0
CONN_10118193-0001LF_AMP = smd 0.406 x 1.346: 1 -1.3,2.607; 2 -0.65,2.607; 3 0,2.607; 4 0.65,2.607; 5 1.3,2.607 | smd 1.6 x 1.397: 6 -3.2,2.382; 7 3.2,2.382 | smd 1.905 x 1.905: 8 -1.2,-0.268; 9 1.2,-0.268 | smd 0.889 x 1.6: 10 -3.3,-0.268; 11 3.3,-0.268 | drill 0.508 pad 0.508: S_1_H1 -3.302,0.076; S_1_H2 -3.302,-0.61; S_2_H1 3.302,0.076; S_2_H2 3.302,-0.61
691137710002 = drill 1.3: 1 -2.5,0; 2 2.5,0
TE_826629-8 = drill 1 square: 1 0,0 | drill 1: 2 2.54,0; 3 5.08,0; 4 7.62,0; 5 10.16,0; 6 12.7,0; 7 15.24,0; 8 17.78,0
DFE252012P-1R0M=P2 = smd 0.8 x 2.007: 1 -1,0; 2 1,0
TRANS_SS8050-G = smd 0.8 x 0.6: 1 -1.01,0.95; 2 -1.01,-0.95; 3 1.01,0
R0402 = smd 0.6 x 0.7: 1 -0.5,0; 2 0.5,0
SPDT_OS102011_CNK = drill 0.787 pad 1.295 square: 1 0,0 | drill 0.787 pad 1.295: 2 0,-2.007; 3 0,-3.988 | drill 1.499 pad 1.499: 4 0,2.108; 5 0,-6.096
SOIC127P600X175-14N = smd 1.97 x 0.6: 1 -2.475,3.81; 2 -2.475,2.54; 3 -2.475,1.27; 4 -2.475,0; 5 -2.475,-1.27; 6 -2.475,-2.54; 7 -2.475,-3.81; 8 2.475,-3.81; 9 2.475,-2.54; 10 2.475,-1.27; 11 2.475,0; 12 2.475,1.27; 13 2.475,2.54; 14 2.475,3.81
ALLEGRO_ACS70331EESATR-005U3 = smd 1.3 x 0.4: 1 -1.35,0.7; 2 -1.35,0.3; 3 -1.35,-0.3; 4 -1.35,-0.7 | smd 0.3 x 0.85: 5 0.15,-1.45; 6 0.65,-1.45; 11 0.65,1.45; 12 0.15,1.45 | smd 0.85 x 0.3: 7 1.35,-0.75; 8 1.35,-0.25; 9 1.35,0.25; 10 1.35,0.75
SOP65P640X110-16N = smd 1.473 x 0.356: 1 -2.921,2.286; 2 -2.921,1.626; 3 -2.921,0.965; 4 -2.921,0.33; 5 -2.921,-0.33; 6 -2.921,-0.965; 7 -2.921,-1.626; 8 -2.921,-2.286; 9 2.921,-2.286; 10 2.921,-1.626; 11 2.921,-0.965; 12 2.921,-0.33; 13 2.921,0.33; 14 2.921,0.965; 15 2.921,1.626; 16 2.921,2.286
SOIC127P599X175-8N = smd 1.97 x 0.6: 1 -2.47,1.905; 2 -2.47,0.635; 3 -2.47,-0.635; 4 -2.47,-1.905; 5 2.47,-1.905; 6 2.47,-0.635; 7 2.47,0.635; 8 2.47,1.905
WQFN-28_FTD = smd 0.914 x 0.254: 1 -2.349,1.5; 2 -2.349,1; 3 -2.349,0.5; 4 -2.349,0; 5 -2.349,-0.5; 6 -2.349,-1; 7 -2.349,-1.5; 15 2.349,-1.5; 16 2.349,-1; 17 2.349,-0.5; 18 2.349,0; 19 2.349,0.5; 20 2.349,1; 21 2.349,1.5 | smd 0.254 x 0.914: 8 -1.5,-2.349; 9 -1,-2.349; 10 -0.5,-2.349; 11 0,-2.349; 12 0.5,-2.349; 13 1,-2.349; 14 1.5,-2.349; 22 1.5,2.349; 23 1,2.349; 24 0.5,2.349; 25 0,2.349; 26 -0.5,2.349; 27 -1,2.349; 28 -1.5,2.349 | smd 3.302 x 3.302: 29 0,0
MLF-6_MT_MCH = smd 0.711 x 0.254: 1 -0.775,0.5; 2 -0.775,0; 3 -0.775,-0.5; 4 0.775,-0.5; 5 0.775,0; 6 0.775,0.5 | smd 0.559 x 1.321: 7 0,0
XCVR_ESP32-WROOM-32E_(16MB) = smd 1.5 x 0.9: 1 -8.75,5.26; 2 -8.75,3.99; 3 -8.75,2.72; 4 -8.75,1.45; 5 -8.75,0.18; 6 -8.75,-1.09; 7 -8.75,-2.36; 8 -8.75,-3.63; 9 -8.75,-4.9; 10 -8.75,-6.17; 11 -8.75,-7.44; 12 -8.75,-8.71; 13 -8.75,-9.98; 14 -8.75,-11.25; 25 8.75,-11.25; 26 8.75,-9.98; 27 8.75,-8.71; 28 8.75,-7.44; 29 8.75,-6.17; 30 8.75,-4.9; 31 8.75,-3.63; 32 8.75,-2.36; 33 8.75,-1.09; 34 8.75,0.18; 35 8.75,1.45; 36 8.75,2.72; 37 8.75,3.99; 38 8.75,5.26 | smd 0.9 x 1.5: 15 -5.715,-12.5; 16 -4.445,-12.5; 17 -3.175,-12.5; 18 -1.905,-12.5; 19 -0.635,-12.5; 20 0.635,-12.5; 21 1.905,-12.5; 22 3.175,-12.5; 23 4.445,-12.5; 24 5.715,-12.5 | smd 0.9 x 0.9: 39_1 -2.9,-1.06; 39_2 -1.5,-1.06; 39_3 -0.1,-1.06; 39_4 -2.9,-2.46; 39_5 -1.5,-2.46; 39_6 -0.1,-2.46; 39_7 -2.9,-3.86; 39_8 -1.5,-3.86; 39_9 -0.1,-3.86 | drill 0.2 pad 0.3: 39_10 -2.2,-1.06; 39_11 -0.8,-1.06; 39_12 -2.9,-1.76; 39_13 -1.5,-1.76; 39_14 -0.1,-1.76; 39_15 -2.2,-2.46; 39_16 -0.8,-2.46; 39_17 -2.9,-3.16; 39_18 -1.5,-3.16; 39_19 -0.1,-3.16; 39_20 -2.2,-3.86; 39_21 -0.8,-3.86
SCD41-D-R1_SEN = smd 1.499 x 0.813: 1 -4,2.5; 2 -4,1.25; 3 -4,0; 4 -4,-1.25; 5 -4,-2.5; 11 4,-2.5; 12 4,-1.25; 13 4,0; 14 4,1.25; 15 4,2.5 | smd 0.813 x 1.499: 6 -2.5,-4; 7 -1.25,-4; 8 0,-4; 9 1.25,-4; 10 2.5,-4; 16 2.5,4; 17 1.25,4; 18 0,4; 19 -1.25,4; 20 -2.5,4 | smd 4.801 x 4.801: 21 0,0
DMB0006A = smd 0.6 x 0.4: 1 -1.4,1; 2 -1.4,0; 3 -1.4,-1; 4 1.4,-1; 5 1.4,0; 6 1.4,1 | smd 1.5 x 2.4: 7 0,0 | drill 0.203 pad 0.508: V -0.508,0; V_1 0.508,0; V_2 -0.508,0.94; V_3 0.508,0.94; V_4 -0.508,-0.94; V_5 0.508,-0.94
SOT23-5-SC189_SEM = smd 0.876 x 0.508: 1 -1.314,0.95; 2 -1.314,0; 3 -1.314,-0.95; 4 1.314,-0.95; 5 1.314,0.95
SOD-523_0P9X1P3_ONS = smd 0.508 x 0.356: 1 -0.8,0; 2 0.8,0
2PIN_HEADER = drill 1.2 pad 1.676 square: 1 -2.5,0; 2 0,0
MQ-7 = drill 1.2 square: 1 -3.81,0; 2 -1.27,0; 3 1.27,0; 4 3.81,0
TPS610333DRLR = smd 0.5 x 0.25: 1 -1,0; 2 -1,-0.5; 3 -1,-1; 4 -1,-1.5; 5 0.5,0; 6 0.5,-0.5; 7 0.5,-1; 8 0.5,-1.5

### Placement (x,y rotation side)
C1  74.63,16.19 0 top
C2  52.07,5.08 270 top
C3  52.07,19.05 270 top
C4  6.5,24 0 top
C5  55.72,42.44 270 top
C6  43.18,29.21 270 top
C7  11,7.5 0 top
C8  45.85,10.64 270 top
C9  22.12,25.4 180 top
C11  41.91,6.35 180 top
C12  52.07,10.16 90 top
C13  35.56,20.32 270 top
C15  1.56,22.26 90 top
C21  74.63,19.05 0 top
C22  62.23,21.61 270 top
C23  83.99,10.11 180 top
C24  86.25,19.83 270 top
C25  27.57,14.44 180 top
C26  34.02,17.04 90 top
C27  26.05,4.6 0 top
C28  55.72,38.63 270 top
D1  10.16,19.05 270 top
D3  39.37,26.67 0 top
D4  18.45,21.61 0 top
D5  13.97,21.61 180 top
J1  3.81,15.24 270 top
J5  18.3,5.4 0 top
J6  62.4,41.4 0 top
J7  62.4,34.2 0 top
L3  41.91,13.97 180 top
L4  39.37,21.59 90 top
Q1  26.28,9.35 180 top
Q2  31.08,13.76 180 top
R3  12.7,11.59 180 top
R22  7.62,21.59 270 top
R34  16.76,11.41 180 top
R35  23.76,16.49 0 top
R39  19.58,25.4 0 top
R40  25.17,6.35 270 top
R41  21.8,14.43 270 top
R42  12.7,10.32 180 top
R43  26.88,6.81 0 top
R44  30.78,16 0 top
R45  45.72,25.4 90 top
R48  39.37,31.32 180 top
R49  53.64,30.19 180 top
R50  45.69,3.22 0 top
R51  83.93,9.05 0 top
R52  85.66,11.3 180 top
R53  56.32,19.05 0 top
R54  59.99,21.61 270 top
R55  50.9,25.4 90 top
R60  72.64,13.07 270 top
R61  26.94,16.14 0 top
R62  37.73,45.78 180 top
R63  38.92,42.57 90 top
SW1  31.72,8.59 0 top
SW2  37.36,8.64 0 top
U1  80.98,19.05 180 top
U2  23.09,21.29 0 top
U3  28.45,21.08 90 top
U4  66.48,14.99 0 top
U5  15.24,16.51 180 top
U6  10.16,24.13 90 top
U7  12.7,36.83 90 top
U8  46.99,41.26 270 top
U9  46.91,30.78 0 top
U10  41.91,10.16 90 top
U11  5,9.5 270 top
U12  8,9.5 270 top
U13  5,21.5 90 top
U$1  62,6 0 top
U$2  67.5,6 180 top
U$3  36.5,36 90 top
U$4  40.64,19.05 90 top
U$5  78,6 0 top

### Tracks (layer width: path | path; a pad name or v marks a point on that pad's centre or on a via)
3V3_BRD  (via drill 0.35)
  Top 0.152: v58.5,44.1 55.99,41.59 C5.2
  Top 0.3: U2.3 U2.4 | 30.07,20.5 30.07,20.57 30.5,21 30.5,22.5 | U$4.8 42.14,22.64 v42.5,23 | U$4.4 42.14,17.59 41.94,17.39
  Top 0.305: U$4.1 39.1,18.05 | U3.7 30.07,20.5
  Top 0.525: U3.16 26.04,24.13 v24.13,24.13 22.54,24.13 C9.2 R39.2 20.18,25.3 v20.18,24.13 | v39.37,24.13 L4.2 37.83,22.59 37.33,22.09 | 37.33,22.09 37.33,19.82 39.1,18.05 39.77,17.39 41.94,17.39 | C28.1 C5.2 53.66,41.59 v53.34,41.91 52.74,42.51 U8.19 | U8.7 43.22,42.51 | 50.76,42.51 U8.19 | U7.2 8.7,28.8 10.38,30.48 v13.37,30.48 | U8.7 43.32,42.51 | 50.66,42.51 U8.19 | v49.2,30.9 49.08,30.78 U9.5 | R62.2 37.11,45.9 v34.5,45.9 | U8.7 41.19,42.51 40.63,43.07 R63.2 34.57,43.07 v34.5,43 | U2.4 21.9,20.43 v21.9,18.98 | U8.7 43.48,42.51 44.17,43.2 44.17,43.83 44.42,44.08 49.56,44.08 49.8,43.83 49.8,43.2 50.5,42.51 U8.19 | v27.94,21.59 28.85,22.5 30.5,22.5 32.5,22.5 33,23 36.42,23 37.33,22.09
  Bottom 0.152: J6.6 72.4,44.1 v58.5,44.1
  Bottom 0.3: v42.5,23 41.37,24.13 v39.37,24.13
  Bottom 0.525: v27.94,21.59 25.4,24.13 v24.13,24.13 20.59,20.59 19.77,20.59 19.31,20.13 19.31,19.47 19.77,19.01 21.87,19.01 v21.9,18.98 | 39.37,24.26 v39.37,24.13 41.91,26.67 46.39,26.67 50.13,30.41 50.13,30.9 | v53.34,41.91 53.34,38.1 50.13,34.89 50.13,30.9 | v20.18,24.13 20.18,24.27 15.85,28.6 15.85,30.48 v13.37,30.48 | 50.13,30.9 v49.2,30.9 | v34.5,45.9 v34.5,43
3V3_EXT  (via drill 0.5)
  Top 0.525: C11.2 40.96,6.45 U10.1 40.96,8.57 | C11.2 40.94,6.23 | C11.2 41.06,6.72 42.86,8.52 U10.3 | v40.2,5 41.06,5.86 C11.2
  Bottom 0.525: J5.1 22.64,12.24 33.63,12.24 33.96,11.91 34.62,11.91 35.01,12.3 38.4,12.3 40.2,10.5 v40.2,5
3V3_REG  (via drill 0.35)
  Top 0.152: v48.6,17.4 v45.9,17.4 | v44.1,13.8 43.08,13.8 L3.1 | J7.5 69.86,31.5 v52.2,31.5
  Top 0.525: U10.4 42.91,11.52 L3.1 42.91,15.29 41.69,16.51 36.83,16.51 35.56,17.78 C13.2 v32.6,19.47 | D4.A 19.64,20.26 v20.1,19.8
  Bottom 0.152: v45.9,17.4 45.9,15.6 v44.1,13.8 | v52.2,31.5 51.94,31.5 49.79,29.35 49.79,28 53,24.79 53,23 48.6,18.6 v48.6,17.4
  Bottom 0.525: v20.1,19.8 32.27,19.8 v32.6,19.47
3V3_SENSE_IN
  Top 0.152: U2.12 23,22.5
  Top 0.3: 21.74,21.9 U2.2
  Top 0.4: 21.74,21.9 22.4,21.9 23,22.5 U2.12
  Top 0.525: 21.74,21.9 U2.1 21.23,22.5 18.15,22.5 D4.C D5.C
3V3_USB  (via drill 0.35)
  Top 0.152: v48.7,15.9 45.9,15.9 v43.6,18.2 | v69,30.31 v66.3,27.61 v66.3,27.6 | U6.6 9.62,24.95
  Top 0.3: R42.2 12.2,7.85 C7.2
  Top 0.525: R42.2 R3.2 12.2,11.93 v10.16,13.97 | 12.7,21.51 D5.A | v24.3,18 24.3,16.53 R35.2 | C15.2 2.56,23.11 5.62,26.17 8.39,26.17 | D5.A 11.9,20.73 v11.9,20.1 | D5.A 11.4,22.99 11.4,25.8 11.03,26.17 8.39,26.17 | 9.62,24.95 8.39,26.17
  Bottom 0.152: v66.3,27.6 63.02,27.6 56.82,21.4 56.82,20.54 52.18,15.9 v48.7,15.9 | v24.3,18 24.35,17.95 43.35,17.95 v43.6,18.2 | J7.4 70.02,31.33 v69,30.31
  Bottom 0.525: v10.16,13.97 10.16,19.46 10.8,20.1 v11.9,20.1 18,20.1 18,19.2 19.2,18 v24.3,18
5V  (via drill 0.35)
  Top 0.4: 61.9,27.86 46.1,27.86 44.03,29.93 44.03,30.76 43.83,30.96 42.23,30.96 38.87,27.6 | 61.9,27.86 63.68,27.86 64.2,28.38 v64.2,30.6 | U4.4 65.58,13.09 | U4.8 67.59,16.89 67.2,16.5 67.2,14.7 65.58,13.09 | C24.2 86.12,19.05 U1.4 82.65,19.05 81.6,18 81.6,13.1 81.07,12.57 R60.2 72.64,12.34 72.3,12 66.67,12 65.58,13.09 | U4.8 68.95,20.81 61.9,27.86 | 38.1,26.7 38.1,26.67 D3.C 38.18,26.91 38.87,27.6 | 38.87,27.6 R48.2 38.87,38.6 37.66,39.81 U$3.4 | 68.95,18.83 U4.8 | U$2.1 U$2.2 67.2,5.7 65.1,5.7
  Top 0.525: 65.1,5.7 v65.1,9.1 | v61.5,12.3 62.28,13.09 U4.4
  Bottom 0.152: v64.2,30.6 66.3,32.7 66.3,35.1 70.5,39.3 78.3,39.3 80.18,41.18 J6.8
  Bottom 0.525: v65.1,9.1 61.9,12.3 v61.5,12.3
5V1
  Top 0.3: C6.2 45.64,25.9 R45.2
  Top 0.4: U$4.6 41.14,26.09 D3.A 41.49,26.67 C6.2
5V_EXT  (via drill 0.35)
  Top 0.305: U6.2 10.16,22.5
  Top 0.406: v14.74,12.7 14.74,12.86 14.24,13.36 U5.23
  Top 0.525: 7.62,22.5 R22.1 | v11.43,19.05 11.28,18.9 10.5,18.9 10.16,19.24 D1.C 10.16,22.5 10.13,22.47 7.65,22.47 7.62,22.5 | C4.2 7.62,23.73 7.62,22.5
  Bottom 0.525: v11.43,19.05 11.43,12.7 v14.74,12.7
555_OUT  (via drill 0.35)
  Top 0.152: v35.56,25.4 28.57,32.38 U7.16 | v60.6,15.8 62.05,14.36 U4.3 | v68.1,27.3 73.8,33 73.8,40.16 J6.5 | v47.72,21.15 v57.43,21.15
  Bottom 0.152: v35.56,25.4 39.73,21.23 39.81,21.15 v47.72,21.15 | v60.6,15.8 60.6,17.98 v57.43,21.15 61.95,21.15 v68.1,27.3
ADC_IN  (via drill 0.35)
  Top 0.152: U3.3 27.48,19.76 29.02,21.3 v29.47,21.3 | v16.81,30.48 16.33,30 U7.8
  Bottom 0.152: v29.47,21.3 20.29,30.48 | 20.29,30.48 v16.81,30.48 | 20.29,30.48 29.46,30.48 32.48,33.5 39.14,33.5 41.95,36.31 45.91,36.31 55.35,45.75 73.29,45.75 J6.7
D1
  Top 0.152: U7.13 22.86,27.9 22.86,26.67 29.14,26.67 29.41,26.4 U3.11
D2
  Top 0.152: U7.14 28.7,28.08 30.07,26.71 U3.10
D3
  Top 0.152: U3.9 30.48,24.26 30.48,26.73 27.71,29.5 22,29.5 21.41,28.91 U7.12
  Top 0.305: U3.9
DTRN  (via drill 0.35)
  Top 0.152: 26.42,7.02 26.38,6.98 R43.1 26.38,8.68 26.7,9 27.6,9 30.88,12.28 32.59,12.28 33.5,13.2 | U5.16 12.75,17.65 12.34,17.65 12.21,17.79 12.21,18.23 12.7,18.73 v12.7,19.05 | v45.6,6.9 52.9,6.9 v55.5,4.3 | v34.29,13.2 33.5,13.2 | Q2.2 32.09,14.61 33.5,13.2
  Bottom 0.152: v12.7,19.05 18.45,13.3 34.19,13.3 v34.29,13.2 34.38,13.29 39.21,13.29 v45.6,6.9 | v55.5,4.3 59.5,4.3 59.51,4.29 78.43,4.29 82.23,8.1 87,8.1 87.6,8.7 87.6,22.5 86.1,24 84.6,24 77.64,30.96 J7.7
EN  (via drill 0.35)
  Top 0.152: R41.2 21.8,13.74 | 23.73,13.5 23.3,13.93 R41.2 | 23.73,13.5 27.28,13.5 C25.1 29.39,14.44 Q2.3 | R42.1 14.04,10.32 14.27,10.09 17.95,10.09 R41.2 | 23.73,13.5 23.73,4.72 25.95,2.5 28.4,2.5 30.84,4.94 30.84,4.96 31.4,5.52 38.21,5.52 39.77,3.96 53.41,3.96 56.04,1.33 76.64,1.33 83.31,8 85.7,8 v86.7,9
  Bottom 0.152: v86.7,9 87.01,9.31 87.01,22.01 85.62,23.4 83.7,23.4 75.1,32 J7.6
GND  (via drill 0.35)  (2 unrouted)
  Top 0.152: 7.62,43.18 7.62,45.4 U7.38 7.62,45.76 | U7.1 7.62,28.26 7.62,29.21 | U5.19 13.04,16.15 13.44,16.15 13.8,16.51 13.97,16.51 | 15.24,15.24 14.74,14.74 U5.24 14.74,13.75 15.02,13.47 15.32,13.47 v16.2,12.6 | U$4.2 41.1,18.09 | 16.2,17.1 16.29,17.01 U5.5 | v51,37.5 50.75,37.5 U8.21 | U5.4 U5.29
  other vias: 24.36,25.4 8.89,31.75 8.89,40.64 20.59,40.64 20.59,31.75 9.89,1.66 39.64,40.64 49.53,26.67 78.9,10.8 71.4,19.7 75.8,8.9 81,11.5 86.4,21.6 81.6,20.4 86.1,15.6 42,32.4 37.3,18.7 39,19.5 11.1,21.6 51,45.3 42.9,45.3 54.6,39.9 25.2,14.4 28.5,5.1 42,5 41,3 25.5,16.5 34.5,14.5 53.5,29 54,24 57,36 57,32.5 57,30 28.5,16.5 52,24 44,35 34.5,29
  pour Bottom: 6.9,46.2 6.9,27.3 3.6,24 0.3,24 0.3,0.3 90,0.3 91.8,2.1 91.8,48.9 88.2,52.5 13.2,52.5
  pour Top: 6.9,46.2 6.9,27.3 3.6,24 0.3,24 -0.9,22.8 -0.9,-2.7 88.2,-2.7 93.6,2.7 93.6,48.6 87.9,54.3 15,54.3
I2C_SCL  (via drill 0.35)
  Top 0.152: U7.36 9.98,43.36 v10.16,43.18 | U9.6 48.31,32.39 v47.7,33 | J6.3 64.78,38.7 55.03,38.7 52.03,35.7 v45,35.7 44.4,35.7 43.85,36.24 43.85,38.1 44.1,38.35 44.1,39.3 43.39,40.01 U8.9 41.5,40 39.43,42.07 R63.1 38.85,42 v35.7,42
  Bottom 0.152: v10.16,43.18 30,43.18 31.18,42 v35.7,42 | v47.7,33 v45,35.7
I2C_SDA  (via drill 0.35)
  Top 0.152: v40.8,39.3 41.34,38.76 U8.10 42.49,38.26 v42.49,35.11 v42.5,35.1 | U9.1 45.51,32.09 v44.7,33 | U7.33 13.79,44.71 14.05,44.45 39,44.45 | v60.6,43.2 56.7,47.1 41.65,47.1 40.33,45.78 | 40.33,45.78 39,44.45 | R62.1 40.33,45.78 | 39,44.45 41.16,44.45 v41.36,44.25
  Bottom 0.152: v40.8,39.3 41.36,39.86 v41.36,44.25 | J6.1 v60.6,43.2 | v42.5,35.1 42.5,35.07 v44.7,33
IO0  (via drill 0.35)
  Top 0.152: Q1.3 24.59,8.67 24.59,6.46 25.17,5.88 R40.2 25.17,5.49 24.82,5.14 24.82,4.05 24.95,3.92 25.98,3.92 v26.7,3.2 | v62.1,2.4 62.7,1.8 70.5,1.8 72.5,3.8 72.5,7 73.5,8 79,8 v80.5,9.5
  Bottom 0.152: v80.5,9.5 84,13 84,13.54 84.01,13.55 84.01,14.75 86.71,17.45 86.71,19.23 84.59,21.35 84.59,21.61 76.8,29.4 68.4,29.4 67.48,30.32 J7.3 | v62.1,2.4 60.82,1.12 28.78,1.12 v26.7,3.2
N$1  (via drill 0.35)
  other vias: 85.2,21.6
N$2  (via drill 0.35)
  Top 0.152: v31.68,17.34 32.63,16.39 C26.1 34.94,16.39 39,12.33 39,8.27 SW2.2 | v20.83,15.7 21.6,14.93 R41.1
  Bottom 0.152: v31.68,17.34 31.18,17.34 29.54,15.7 v20.83,15.7
N$3  (via drill 0.35)
  Top 0.152: R51.2 84.43,9.9 C23.1 84.93,10.4 v86.1,10.4
  Top 0.2: U1.6 84.17,20.87 84.5,20.87 85.59,19.78 86.81,19.78 86.95,19.64 86.95,14.95 v86.1,14.1 | R52.1 86.16,10.46 v86.1,10.4
  Bottom 0.2: v86.1,14.1 v86.1,10.4
N$4  (via drill 0.35)
  Top 0.152: 87.6,14.25 85.16,11.81 R52.2 83.66,11.3 83.43,11.07 83.34,10.98 C23.2
  Top 0.2: 87.6,14.25 87.6,21.9 86.64,22.86 U1.7 81.06,22.86 v81,22.8
  Top 0.3: C3.2 v61.7,17.04
  Bottom 0.2: v61.7,17.04 63,17.04 68.16,22.2 80.4,22.2 v81,22.8
N$5
  Top 0.3: C3.1 R53.1
N$6  (via drill 0.35)
  Top 0.152: v64.2,22.2 62.29,22.2 C22.1
  Top 0.3: R53.2 59.88,22.11 R54.1 60.14,22.26 C22.1 | v85.2,18.1 84.88,17.78 U1.3
  Bottom 0.152: v85.2,18.1 85.2,19.8 80.7,24.3 66.3,24.3 v64.2,22.2
N$7  (via drill 0.35)
  Top 0.152: U2.10 27.12,22.04 28.12,23.04 U3.13 28.12,25.68 v28.5,26.06 | v31.8,43.8 32.8,42.8 v32.8,30.3 | v58.8,46.5 61.8,43.5 67.92,43.5 J6.4
  Bottom 0.152: v28.5,26.06 28.56,26.06 v32.8,30.3 | v31.8,43.8 33.3,45.3 33.3,46.8 34.2,47.7 57.6,47.7 v58.8,46.5
N$8
  Top 0.2: U4.6 71.86,14.36 R60.1 73.78,14.71 C1.1
N$9  (via drill 0.35)
  Top 0.152: v52.8,26.8 51.8,26.8 R55.2 49.5,24.5 v49.5,24 | 51.86,30.19 R49.2 | R48.1 39.87,32.37 41.12,33.62 48.43,33.62 51.86,30.19 | v45.9,13.8 45.9,12.09 C8.1 | v51.9,29.1 51.9,30.15 51.86,30.19
  Top 0.3: v86.1,17.7 84.91,16.51 U1.2
  Bottom 0.152: 52.84,26.84 v52.8,26.8 | 52.9,26.9 v52.8,26.8 | v86.1,17.7 86,17.8 86,19.43 76.63,28.8 54.8,28.8 v52.8,26.8 | v52.8,26.8 52.8,28.2 v51.9,29.1 | v49.5,24 49.5,20.72 46.95,18.18 46.95,14.86 v45.9,13.8
N$10
  Top 0.152: C27.1 25.4,5.11 25.75,5.46 25.75,6 | R40.1 25.75,6.27 25.75,6 | 25.75,6 25.98,6.23 27.77,6.23 28.13,6.58 SW1.2
N$12
  Top 0.152: R51.1 81.93,9.05 80.82,10.16 C12.1
N$16  (via drill 0.35)
  Top 0.152: v27.34,25.4 27.48,25.26 U3.14 | v59.9,39.6 v57.3,39.6
  Bottom 0.152: v27.34,25.4 34.29,25.4 36.83,27.94 36.83,31.86 U$3.1 40.93,32.19 41.75,33.01 43.21,33.01 43.22,33.02 43.85,32.39 47.95,32.39 49.64,34.08 49.64,39.07 53.09,42.52 54.38,42.52 v57.3,39.6 | J6.2 63.14,39.6 v59.9,39.6
N$19
  Top 0.2: U4.5 68.94,13.07 67.94,13.07 67.71,13.3 67.71,15.99 67.9,16.18 71.11,16.18 C21.1
N$20
  Top 0.152: U13.1 5,19.33 5.23,19.1 5.23,16.77 5.5,16.5 6.38,16.5 J1.1
  Top 0.3: D1.A 8.84,16.54 J1.1
N$21
  Top 0.152: U3.6 29.41,17.5 29.36,17.5 29.05,17.2 28,17.2 27.44,16.64 R61.2
N$22
  Top 0.152: J1.2 5.39,15.89 5.23,15.73 5.23,11.38 5,11.15 U11.1
  Top 0.3: J1.2 11.5,15.89 11.88,15.51 U5.20
N$23
  Top 0.152: J1.3 6.42,15.17 | U12.1 8,15.24
  Top 0.3: J1.3 8,15.24 11.43,15.24 11.66,15.01 U5.21
N$24
  Top 0.152: R43.2 27.29,6.9 Q1.1
N$25
  Top 0.152: 31.28,15.94 R44.2 31.28,13.62 Q2.1
N$26  (via drill 0.35)
  Top 0.152: U5.3 18.55,16.01 v19.05,16.51 | R35.1 23.11,16.49 22.5,17.1 v22.2,17.1
  Bottom 0.152: v19.05,16.51 21.61,16.51 v22.2,17.1
N$27  (via drill 0.35)
  Top 0.3: R22.2 v7.62,17.78 | R34.1 17.26,12.55 v17.41,12.7 | 17.2,12.7 v17.41,12.7 | v17.41,12.7 17.14,12.7 16.44,13.4 15.99,13.4 15.74,13.65 U5.26
  Bottom 0.3: v7.62,17.78 8.89,16.51 8.89,11.43 16.14,11.43 v17.41,12.7
N$28
  Top 0.152: R39.1 13.71,25.4 12.14,26.97 9.98,26.97 U7.3
N$29  (via drill 0.35)
  Top 0.152: v59.7,2.55 v59.69,2.54 | R50.2 51.92,3.22 C2.2
  Top 0.4: v59.69,2.54 59.69,5.81 U$1.1 U$1.2
  Bottom 0.152: C2.2 59.16,3.07 v59.69,2.54
N$30  (via drill 0.35)
  Top 0.152: U5.2 18.78,15.51 v19.05,15.24 | v20.32,13.97 20.32,12.99 17.77,10.43 14.36,10.43 R3.1
  Bottom 0.152: v20.32,13.97 v19.05,15.24
N$55
  Top 0.152: 40.91,11.52 U10.5
  Top 0.525: L3.2 40.91,11.52
N$56
  Top 0.152: U$4.5 39.6,20.59 L4.1
N$57
  Top 0.152: U$4.7 41.79,19.4 41.79,19.2 41.94,19.05 43.18,19.05 45.72,21.59 R45.1
N$60  (via drill 0.35)
  Top 0.152: R55.1 51,24.8 v51,22.7 | v80.1,17.5 82.92,20.32 U1.5
  Bottom 0.152: v51,22.7 51,21.79 47.76,18.55 47.76,9.39 C2.1 55.17,8.18 73.88,8.18 79,13.29 79,16.47 80.03,17.5 v80.1,17.5
RTSN  (via drill 0.35)
  Top 0.152: U5.8 16.93,19.05 19.05,19.05 22.93,15.17 29.45,15.17 R44.1 30.28,14.87 30.7,14.46 30.7,13.06 27.93,10.3 Q1.2 26.6,10.3 v25.8,11.1 | v47.95,8.35 49.18,9.58 49.18,12.54 51.35,14.7 v53.5,14.7 | v57.9,18.3 62.1,18.3 v63.9,20.1 | v79.8,23.69 79.8,33.82 J7.8
  Bottom 0.152: v25.8,11.1 27.59,11.1 30.98,7.71 37.52,7.71 39.02,6.21 39.02,3.72 40.42,2.32 41.88,2.32 47.9,8.35 v47.95,8.35 | v53.5,14.7 54.3,14.7 v57.9,18.3 | v63.9,20.1 67.49,23.69 v79.8,23.69
RXD0  (via drill 0.35)
  Top 0.152: U7.34 12.52,44.5 13.22,43.8 | 13.22,43.8 v28.5,43.8 | v53.4,45.3 56.7,45.3 v57,45 | v12.7,35.56 12.7,43.28 13.22,43.8 | U5.11 15.1,19 15.1,19.41 13.6,20.91 13.6,24.4 v13.5,24.5
  Bottom 0.152: v12.7,35.56 12.7,27.57 13.5,26.77 v13.5,24.5 | v53.4,45.3 51.86,45.3 50.65,46.51 34.25,46.51 33.8,46.06 33.8,44.94 32.05,43.19 31.55,43.19 30.94,43.8 v28.5,43.8 | v57,45 57,41.14 61.94,36.2 62.94,36.2 J7.2
THRESH_NET  (via drill 0.35)
  Top 0.152: C22.2 67.54,20.96 v67.8,20.7
  Top 0.3: R54.2 62.08,21.11 C22.2 | 69.45,15.5 69.5,15.5 v71,15.5 | U1.1 83,14.79 v83,14 | v66,15.5 64.14,15.5 U4.2
  Top 0.4: U4.7 69.38,15.62 69.5,15.5
  Bottom 0.152: v67.8,20.7 68,20.7 v80.1,20.7
  Bottom 0.3: 68,20.7 68.8,20.7 71,18.5 v71,15.5 v66,15.5 | v83,14 81.5,15.5 81.5,19.5 80.3,20.7 v80.1,20.7
TXD0  (via drill 0.35)
  Top 0.152: v14.94,29.38 14.94,29.88 12.72,32.1 | 12.72,32.1 11.25,33.57 U7.35 | v52.2,34.2 v52.19,34.19 41.81,34.19 v39.9,36.1 | v16.8,32.1 12.72,32.1 | U5.10 15.6,19 15.6,19.41 14.4,20.6 14.4,24.41 v14.5,24.5
  Bottom 0.152: v14.94,29.38 14.94,26.6 15.24,26.3 15.24,25.24 v14.5,24.5 | v39.9,36.1 20.8,36.1 v16.8,32.1 | J7.1 v52.2,34.2
VCCIO
  Top 0.152: U5.6 19.32,17.51 19.8,17.03 19.8,14.42 18.9,13.52 18.9,12 17.73,10.83 15.87,10.83 15.16,11.54 15.13,11.54 | 15.13,11.54 15.24,11.43 | U5.22 13.74,11.93 14.13,11.54 15.13,11.54
(copper drawn outside any net)
  shapes: Bottom area x1

### Text on the board
tPlace: 40mm up from / other hole | MQ_7 | CURR | 3V3_BRD | 5V | 40mm high, / 24mm wide, / TBD thickness | I2C_SDA | I2C_SCL | 555_OUT | ADC_IN | RXD0 | 3V3_USB | EN | RTSN | TXD0 | IO0 | 3V3_REG | DTRN | 5mm up, 5mm right from / bottom left corner | 4mm left, 5mm up / from bottom right corner
bPlace: BS | YCP